# EAGLE schematic Clocks_Freq_Synth_board (EAGLE 9.6.2)
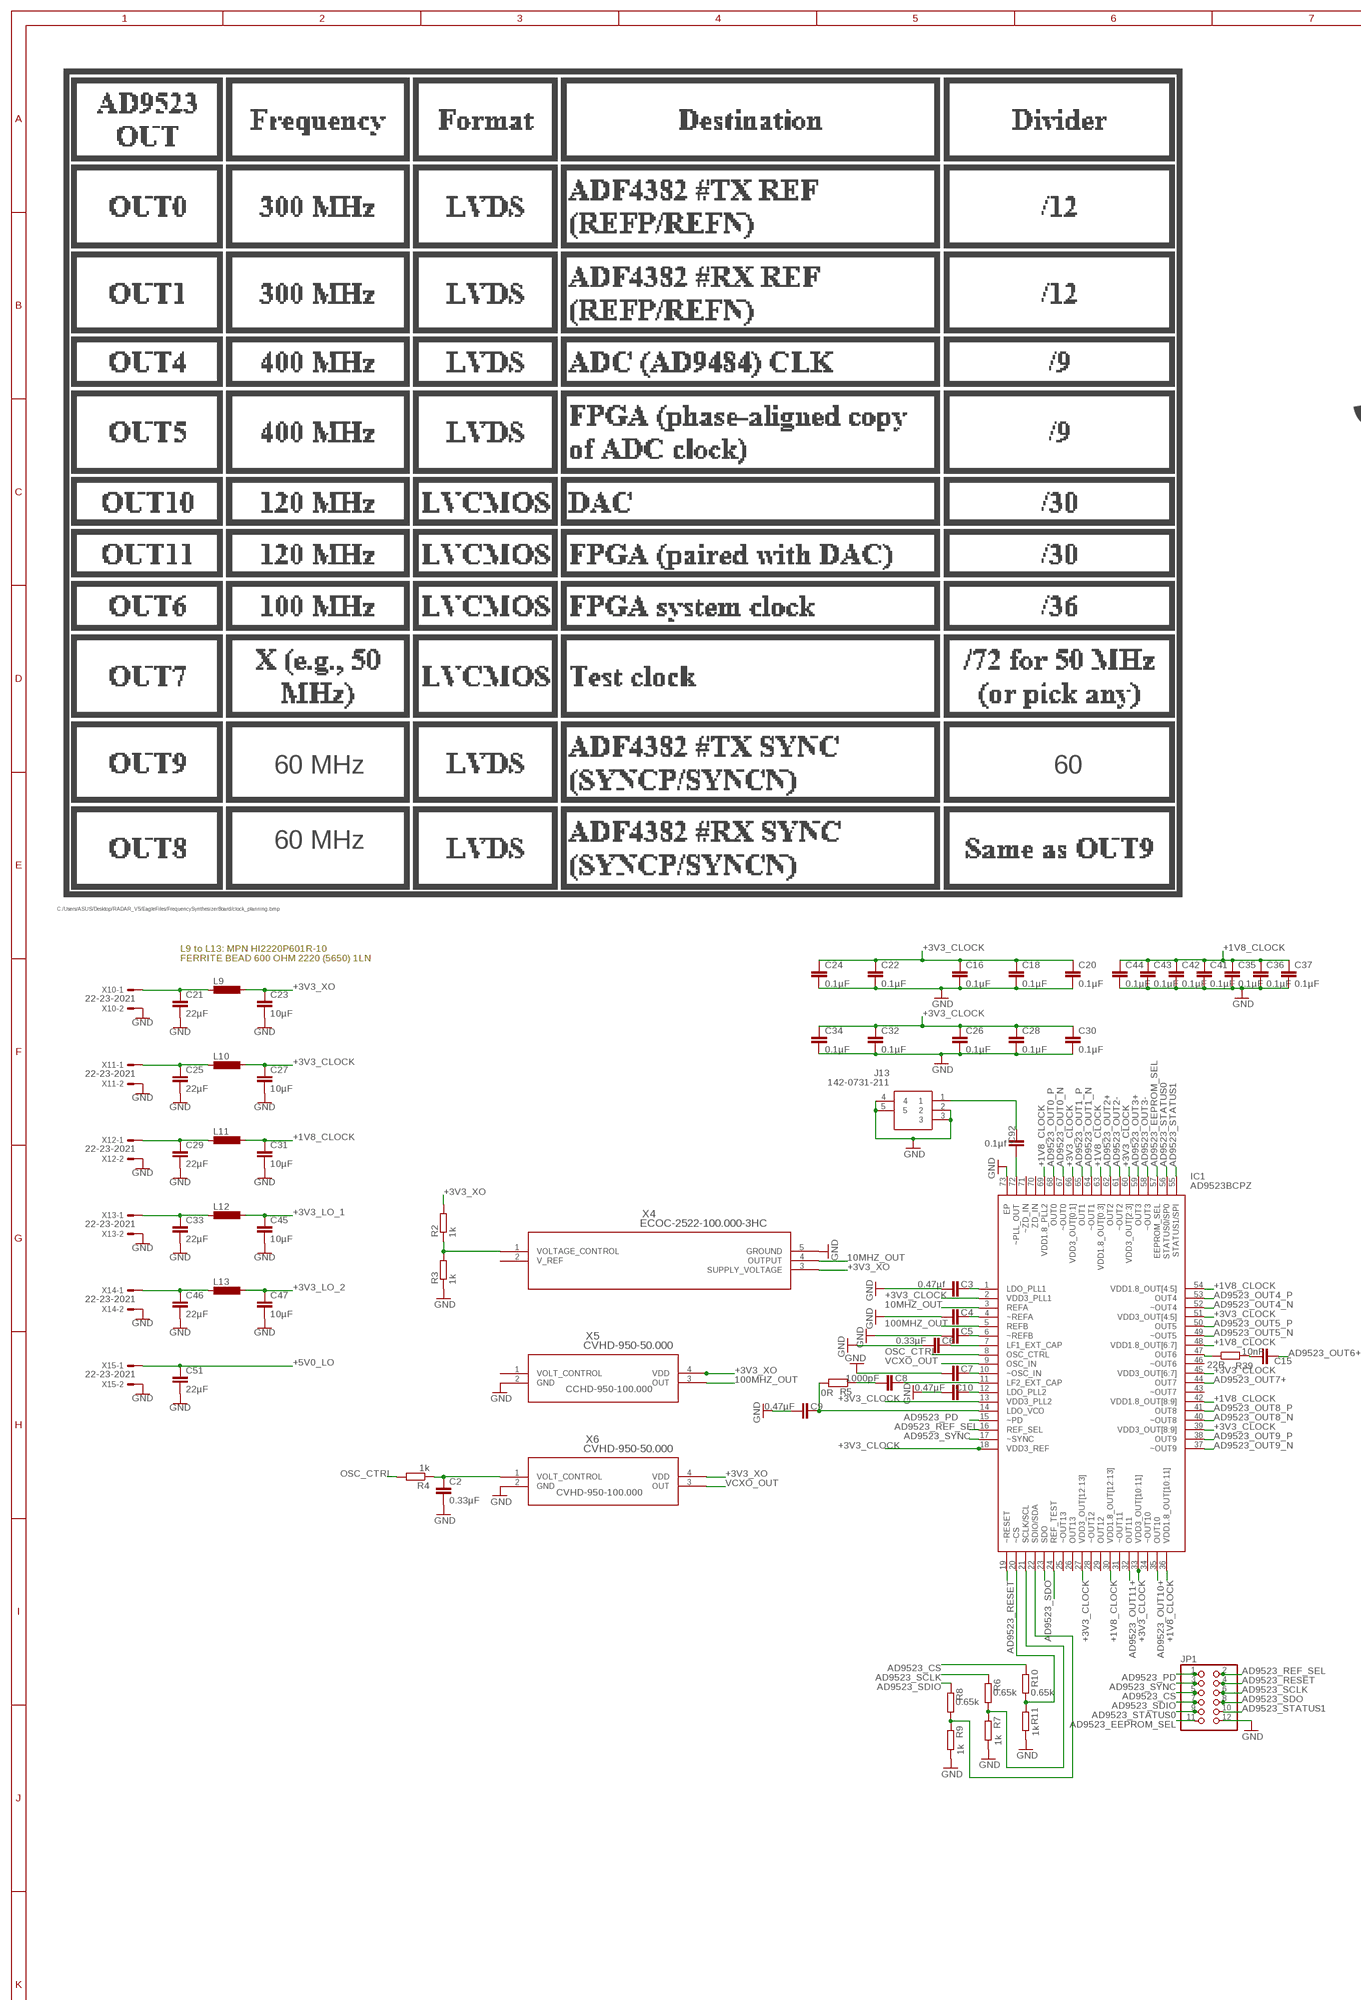
[diagram p0: schematic, sheet 1, part 1 of 3]
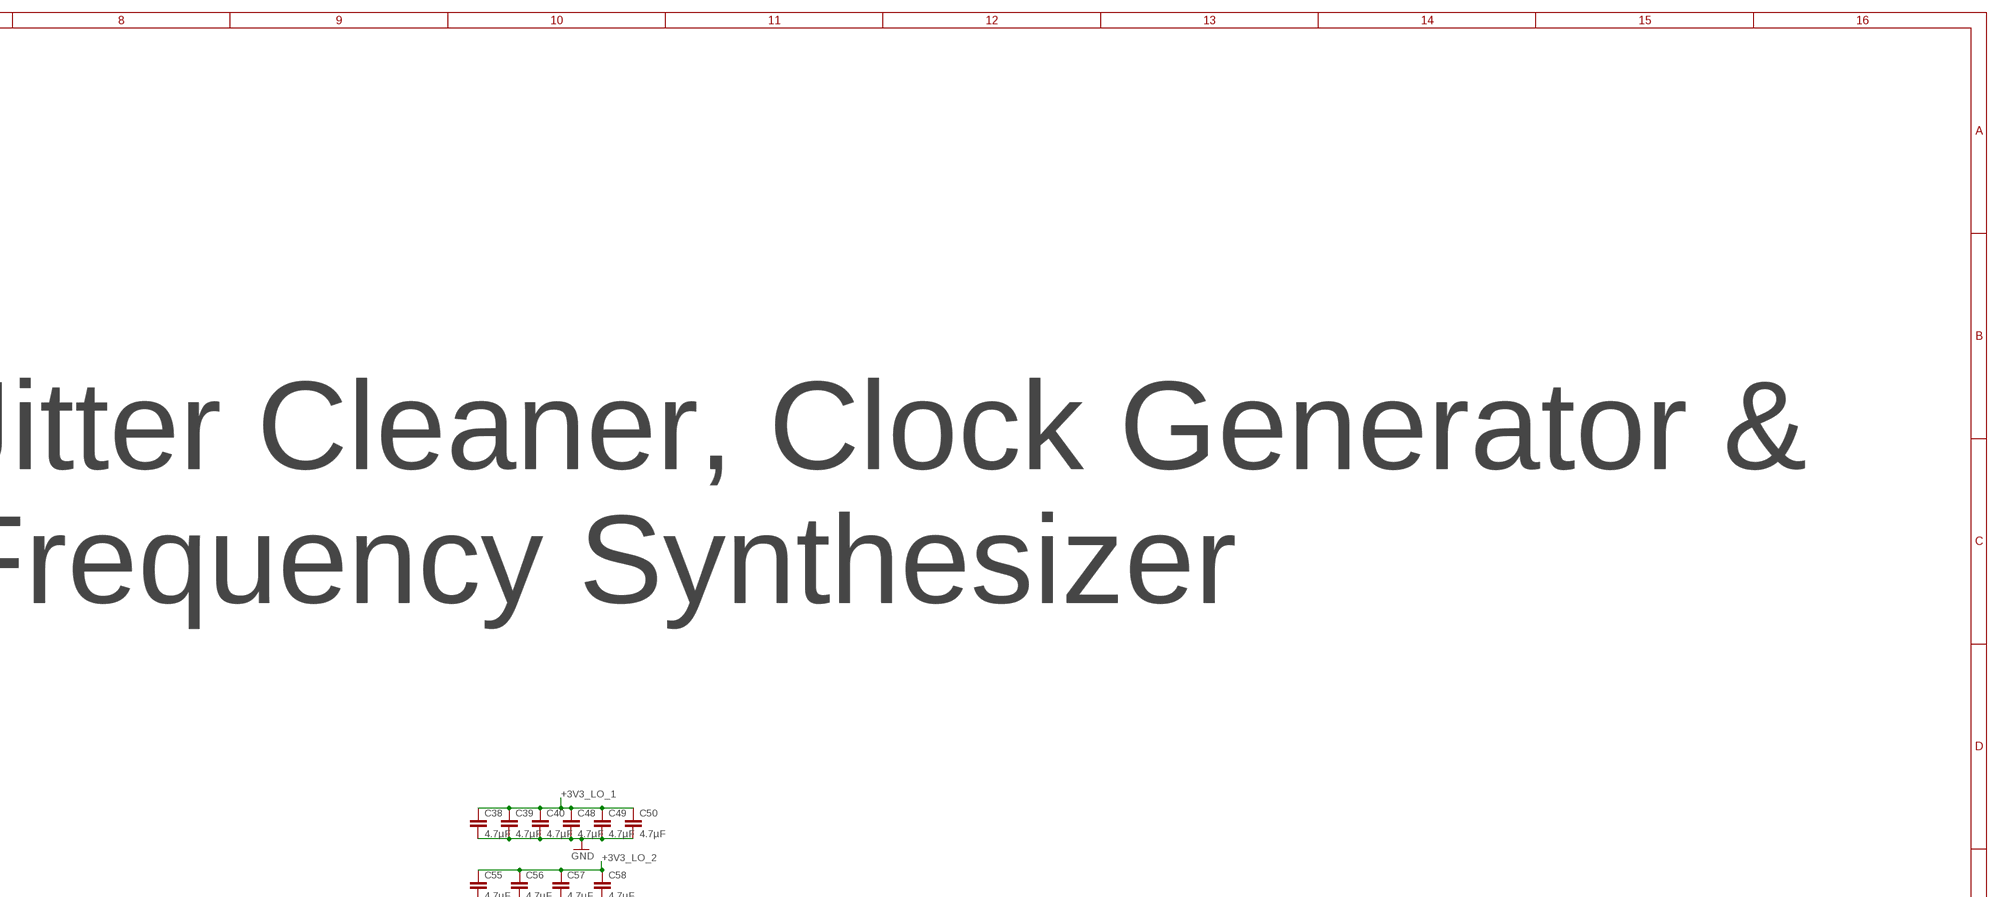
[diagram p1: schematic, sheet 1, part 2 of 3]
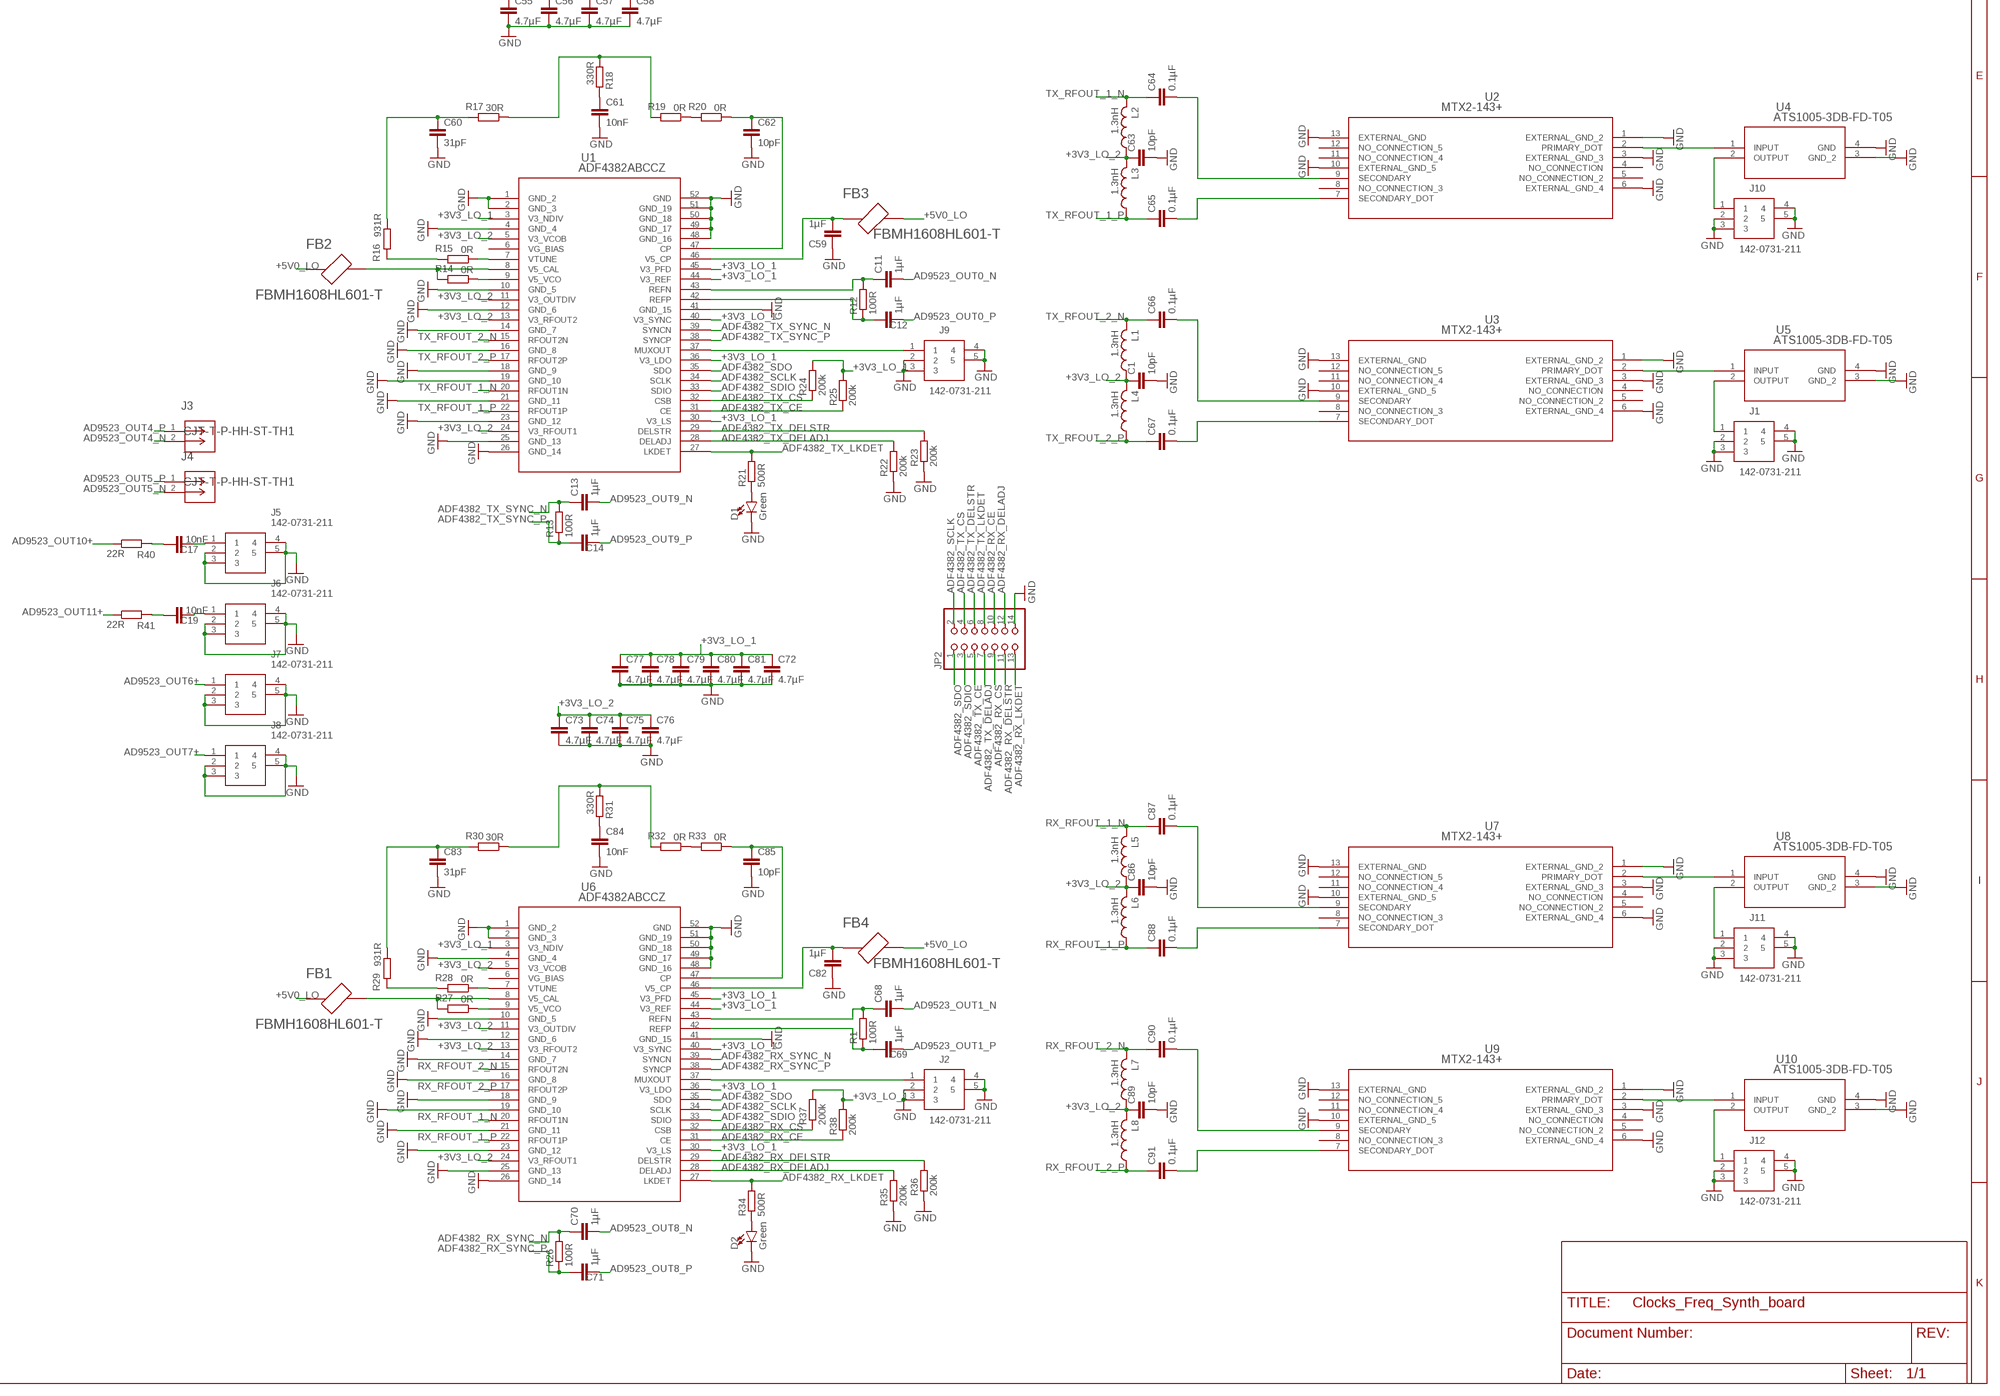
[diagram p2: schematic, sheet 1, part 3 of 3]

## Parts
C1  10pF  C-EUC0201  [C0201]
C2  0.33µF  C-EUC0201  [C0201]
C3  0.47µf  C-EUC0201  [C0201]
C4  C-EUC0201  [C0201]
C5  C-EUC0201  [C0201]
C6  0.33µF  C-EUC0201  [C0201]
C7  C-EUC0201  [C0201]
C8  1000pF  C-EUC0201  [C0201]
C9  0.47µF  C-EUC0201  [C0201]
C10  0.47µF  C-EUC0201  [C0201]
C11  1µF  C-EUC0201  [C0201]
C12  1µF  C-EUC0201  [C0201]
C13  1µF  C-EUC0201  [C0201]
C14  1µF  C-EUC0201  [C0201]
C15  10nF  C-EUC0402  [C0402]
C16  0.1µF  C-EUC0201  [C0201]
C17  10nF  C-EUC0402  [C0402]
C18  0.1µF  C-EUC0201  [C0201]
C19  10nF  C-EUC0402  [C0402]
C20  0.1µF  C-EUC0201  [C0201]
C21  22µF  C-EUC1210  [C1210]
C22  0.1µF  C-EUC0201  [C0201]
C23  10µF  C-EUC1210  [C1210]
C24  0.1µF  C-EUC0201  [C0201]
C25  22µF  C-EUC1210  [C1210]
C26  0.1µF  C-EUC0201  [C0201]
C27  10µF  C-EUC1210  [C1210]
C28  0.1µF  C-EUC0201  [C0201]
C29  22µF  C-EUC1210  [C1210]
C30  0.1µF  C-EUC0201  [C0201]
C31  10µF  C-EUC1210  [C1210]
C32  0.1µF  C-EUC0201  [C0201]
C33  22µF  C-EUC1210  [C1210]
C34  0.1µF  C-EUC0201  [C0201]
C35  0.1µF  C-EUC0201  [C0201]
C36  0.1µF  C-EUC0201  [C0201]
C37  0.1µF  C-EUC0201  [C0201]
C38  4.7µF  C-EUC0201  [C0201]
C39  4.7µF  C-EUC0201  [C0201]
C40  4.7µF  C-EUC0201  [C0201]
C41  0.1µF  C-EUC0201  [C0201]
C42  0.1µF  C-EUC0201  [C0201]
C43  0.1µF  C-EUC0201  [C0201]
C44  0.1µF  C-EUC0201  [C0201]
C45  10µF  C-EUC1210  [C1210]
C46  22µF  C-EUC1210  [C1210]
C47  10µF  C-EUC1210  [C1210]
C48  4.7µF  C-EUC0201  [C0201]
C49  4.7µF  C-EUC0201  [C0201]
C50  4.7µF  C-EUC0201  [C0201]
C51  22µF  C-EUC1210  [C1210]
C55  4.7µF  C-EUC0201  [C0201]
C56  4.7µF  C-EUC0201  [C0201]
C57  4.7µF  C-EUC0201  [C0201]
C58  4.7µF  C-EUC0201  [C0201]
C59  1µF  C-EUC0201  [C0201]
C60  31pF  C-EUC0201  [C0201]
C61  10nF  C-EUC0201  [C0201]
C62  10pF  C-EUC0201  [C0201]
C63  10pF  C-EUC0201  [C0201]
C64  0.1µF  C-EUC0201  [C0201]
C65  0.1µF  C-EUC0201  [C0201]
C66  0.1µF  C-EUC0201  [C0201]
C67  0.1µF  C-EUC0201  [C0201]
C68  1µF  C-EUC0201  [C0201]
C69  1µF  C-EUC0201  [C0201]
C70  1µF  C-EUC0201  [C0201]
C71  1µF  C-EUC0201  [C0201]
C72  4.7µF  C-EUC0201  [C0201]
C73  4.7µF  C-EUC0201  [C0201]
C74  4.7µF  C-EUC0201  [C0201]
C75  4.7µF  C-EUC0201  [C0201]
C76  4.7µF  C-EUC0201  [C0201]
C77  4.7µF  C-EUC0201  [C0201]
C78  4.7µF  C-EUC0201  [C0201]
C79  4.7µF  C-EUC0201  [C0201]
C80  4.7µF  C-EUC0201  [C0201]
C81  4.7µF  C-EUC0201  [C0201]
C82  1µF  C-EUC0201  [C0201]
C83  31pF  C-EUC0201  [C0201]
C84  10nF  C-EUC0201  [C0201]
C85  10pF  C-EUC0201  [C0201]
C86  10pF  C-EUC0201  [C0201]
C87  0.1µF  C-EUC0201  [C0201]
C88  0.1µF  C-EUC0201  [C0201]
C89  10pF  C-EUC0201  [C0201]
C90  0.1µF  C-EUC0201  [C0201]
C91  0.1µF  C-EUC0201  [C0201]
C92  0.1µf  C-EUC0201  [C0201]
D1  Green  LED-GREEN-0603-WE  [LED-0603]
D2  Green  LED-GREEN-0603-WE  [LED-0603]
FB1  FBMH1608HL601-T  [BEADC1608X90N]
FB2  FBMH1608HL601-T  [BEADC1608X90N]
FB3  FBMH1608HL601-T  [BEADC1608X90N]
FB4  FBMH1608HL601-T  [BEADC1608X90N]
IC1  AD9523BCPZ  [QFN50P1000X1000X100-73N]
J1  142-0731-211  [1420731211]
J2  142-0731-211  [1420731211]
J3  CJT-T-P-HH-ST-TH1  [CONN_CJT-T-P-XX-ST-TH1_SAI]
J4  CJT-T-P-HH-ST-TH1  [CONN_CJT-T-P-XX-ST-TH1_SAI]
J5  142-0731-211  [1420731211]
J6  142-0731-211  [1420731211]
J7  142-0731-211  [1420731211]
J8  142-0731-211  [1420731211]
J9  142-0731-211  [1420731211]
J10  142-0731-211  [1420731211]
J11  142-0731-211  [1420731211]
J12  142-0731-211  [1420731211]
J13  142-0731-211  [1420731211]
JP1  PINHD-2X6  [2X06]
JP2  PINHD-2X7  [2X07]
L1  1.3nH  L-USL0201  [L0201]
L2  1.3nH  L-USL0201  [L0201]
L3  1.3nH  L-USL0201  [L0201]
L4  1.3nH  L-USL0201  [L0201]
L5  1.3nH  L-USL0201  [L0201]
L6  1.3nH  L-USL0201  [L0201]
L7  1.3nH  L-USL0201  [L0201]
L8  1.3nH  L-USL0201  [L0201]
L9  L-EUL5650M  [L5650M]
L10  L-EUL5650M  [L5650M]
L11  L-EUL5650M  [L5650M]
L12  L-EUL5650M  [L5650M]
L13  L-EUL5650M  [L5650M]
R1  100R  R-EU_R0201  [R0201]
R2  1k  R-EU_R0201  [R0201]
R3  1k  R-EU_R0201  [R0201]
R4  1k  R-EU_R0201  [R0201]
R5  0R  R-EU_R0201  [R0201]
R6  0.65k  R-EU_R0201  [R0201]
R7  1k  R-EU_R0201  [R0201]
R8  0.65k  R-EU_R0201  [R0201]
R9  1k  R-EU_R0201  [R0201]
R10  0.65k  R-EU_R0201  [R0201]
R11  1k  R-EU_R0201  [R0201]
R12  100R  R-EU_R0201  [R0201]
R13  100R  R-EU_R0201  [R0201]
R14  0R  R-EU_R0201  [R0201]
R15  0R  R-EU_R0201  [R0201]
R16  931R  R-EU_R0201  [R0201]
R17  30R  R-EU_R0201  [R0201]
R18  330R  R-EU_R0201  [R0201]
R19  0R  R-EU_R0201  [R0201]
R20  0R  R-EU_R0201  [R0201]
R21  500R  R-EU_R0201  [R0201]
R22  200k  R-EU_R0201  [R0201]
R23  200k  R-EU_R0201  [R0201]
R24  200k  R-EU_R0201  [R0201]
R25  200k  R-EU_R0201  [R0201]
R26  100R  R-EU_R0201  [R0201]
R27  0R  R-EU_R0201  [R0201]
R28  0R  R-EU_R0201  [R0201]
R29  931R  R-EU_R0201  [R0201]
R30  30R  R-EU_R0201  [R0201]
R31  330R  R-EU_R0201  [R0201]
R32  0R  R-EU_R0201  [R0201]
R33  0R  R-EU_R0201  [R0201]
R34  500R  R-EU_R0201  [R0201]
R35  200k  R-EU_R0201  [R0201]
R36  200k  R-EU_R0201  [R0201]
R37  200k  R-EU_R0201  [R0201]
R38  200k  R-EU_R0201  [R0201]
R39  22R  R-EU_R0201  [R0201]
R40  22R  R-EU_R0201  [R0201]
R41  22R  R-EU_R0201  [R0201]
U1  ADF4382ABCCZ  [CC-48-10_ADI]
U2  MTX2-143+  [DQ1225_MNC]
U3  MTX2-143+  [DQ1225_MNC]
U4  ATS1005-3DB-FD-T05  [SMT_DB-FD-T05_SUS]
U5  ATS1005-3DB-FD-T05  [SMT_DB-FD-T05_SUS]
U6  ADF4382ABCCZ  [CC-48-10_ADI]
U7  MTX2-143+  [DQ1225_MNC]
U8  ATS1005-3DB-FD-T05  [SMT_DB-FD-T05_SUS]
U9  MTX2-143+  [DQ1225_MNC]
U10  ATS1005-3DB-FD-T05  [SMT_DB-FD-T05_SUS]
X4  ECOC-2522-100.000-3HC  [SMD5_ECOC-2522_25P4X22_ECS]
X5  CVHD-950-50.000  [SMD4_CVHD-950_CRX]
X6  CVHD-950-50.000  [SMD4_CVHD-950_CRX]
X10  22-23-2021  [22-23-2021]
X11  22-23-2021  [22-23-2021]
X12  22-23-2021  [22-23-2021]
X13  22-23-2021  [22-23-2021]
X14  22-23-2021  [22-23-2021]
X15  22-23-2021  [22-23-2021]

## Nets
10MHZ_OUT: IC1.3(REFA) X4.4(OUTPUT)
100MHZ_OUT: IC1.5(REFB) X5.3(OUT)
+1V8_CLOCK: C31.1 C35.1 C36.1 C37.1 C41.1 C42.1 C43.1 C44.1 IC1.30(VDD1.8_OUT[12:13]) IC1.36(VDD1.8_OUT[10:11]) IC1.42(VDD1.8_OUT[8:9]) IC1.48(VDD1.8_OUT[6:7]) IC1.54(VDD1.8_OUT[4:5]) IC1.63(VDD1.8_OUT[0:3]) IC1.69(VDD1.8_PLL2) L11.1
+3V3_CLOCK: C16.1 C18.1 C20.1 C22.1 C24.1 C26.1 C27.1 C28.1 C30.1 C32.1 C34.1 IC1.2(VDD3_PLL1) IC1.13(VDD3_PLL2) IC1.18(VDD3_REF) IC1.27(VDD3_OUT[12:13]) IC1.33(VDD3_OUT[10:11]) IC1.39(VDD3_OUT[8:9]) IC1.45(VDD3_OUT[6:7]) IC1.51(VDD3_OUT[4:5]) IC1.60(VDD3_OUT[2:3]) IC1.66(VDD3_OUT[0:1]) L10.1
+3V3_LO_1: C38.1 C39.1 C40.1 C45.1 C48.1 C49.1 C50.1 C72.1 C77.1 C78.1 C79.1 C80.1 C81.1 L12.1 R24.2 R25.2 R37.2 R38.2 U1.3(V3_NDIV) U1.30(V3_LS) U1.36(V3_LDO) U1.40(V3_SYNC) U1.44(V3_REF) U1.45(V3_PFD) U6.3(V3_NDIV) U6.30(V3_LS) U6.36(V3_LDO) U6.40(V3_SYNC) U6.44(V3_REF) U6.45(V3_PFD)
+3V3_LO_2: C1.1 C47.1 C55.1 C56.1 C57.1 C58.1 C63.1 C73.1 C74.1 C75.1 C76.1 C86.1 C89.1 L1.1 L2.1 L3.2 L4.2 L5.1 L6.2 L7.1 L8.2 L13.1 U1.5(V3_VCOB) U1.11(V3_OUTDIV) U1.13(V3_RFOUT2) U1.24(V3_RFOUT1) U6.5(V3_VCOB) U6.11(V3_OUTDIV) U6.13(V3_RFOUT2) U6.24(V3_RFOUT1)
+3V3_XO: C23.1 L9.1 R2.2 X4.3(SUPPLY_VOLTAGE) X5.4(VDD) X6.4(VDD)
+5V0_LO: C51.1 FB1.1 FB2.1 FB3.2 FB4.2 X15.1
AD9523_CS: JP1.5 R10.1
AD9523_EEPROM_SEL: IC1.57(EEPROM_SEL) JP1.11
AD9523_OUT0_N [Differential]: C11.2 IC1.67(~OUT0)
AD9523_OUT0_P [Differential]: C12.2 IC1.68(OUT0)
AD9523_OUT1_N [Differential]: C68.2 IC1.64(~OUT1)
AD9523_OUT1_P [Differential]: C69.2 IC1.65(OUT1)
AD9523_OUT2+: IC1.62(OUT2)
AD9523_OUT2-: IC1.61(~OUT2)
AD9523_OUT3+: IC1.59(OUT3)
AD9523_OUT3-: IC1.58(~OUT3)
AD9523_OUT4_N [Differential]: IC1.52(~OUT4) J3.2
AD9523_OUT4_P [Differential]: IC1.53(OUT4) J3.1
AD9523_OUT5_N [Differential]: IC1.49(~OUT5) J4.2
AD9523_OUT5_P [Differential]: IC1.50(OUT5) J4.1
AD9523_OUT6+: C15.2 J7.1
AD9523_OUT6_DRV: IC1.47(OUT6) R39.1
AD9523_OUT6_SER: C15.1 R39.2
AD9523_OUT7+: IC1.44(OUT7) J8.1
AD9523_OUT8_N [Differential]: C70.2 IC1.40(~OUT8)
AD9523_OUT8_P [Differential]: C71.2 IC1.41(OUT8)
AD9523_OUT9_N [Differential]: C13.2 IC1.37(~OUT9)
AD9523_OUT9_P [Differential]: C14.2 IC1.38(OUT9)
AD9523_OUT10+: IC1.35(OUT10) R40.1
AD9523_OUT10_SER: C17.1 R40.2
AD9523_OUT11+: IC1.32(OUT11) R41.1
AD9523_OUT11_SER: C19.1 R41.2
AD9523_PD: IC1.15(~PD) JP1.1
AD9523_REF_SEL: IC1.16(REF_SEL) JP1.2
AD9523_RESET: IC1.19(~RESET) JP1.4
AD9523_SCLK: JP1.6 R6.1
AD9523_SDIO: JP1.7 R8.1
AD9523_SDO: IC1.23(SDO) JP1.8
AD9523_STATUS0: IC1.56(STATUS0/SP0) JP1.9
AD9523_STATUS1: IC1.55(STATUS1/SPI) JP1.10
AD9523_SYNC: IC1.17(~SYNC) JP1.3
ADF4382_RX_CE: JP2.10 R38.1 U6.31(CE)
ADF4382_RX_CS: JP2.9 R37.1 U6.32(CSB)
ADF4382_RX_DELADJ: JP2.12 R35.2 U6.28(DELADJ)
ADF4382_RX_DELSTR: JP2.11 R36.2 U6.29(DELSTR)
ADF4382_RX_LKDET: JP2.13 R34.2 U6.27(LKDET)
ADF4382_RX_SYNC_N [Differential]: C70.1 R26.2 U6.39(SYNCN)
ADF4382_RX_SYNC_P [Differential]: C71.1 R26.1 U6.38(SYNCP)
ADF4382_SCLK: JP2.2 U1.34(SCLK) U6.34(SCLK)
ADF4382_SDIO: JP2.3 U1.33(SDIO) U6.33(SDIO)
ADF4382_SDO: JP2.1 U1.35(SDO) U6.35(SDO)
ADF4382_TX_CE: JP2.5 R25.1 U1.31(CE)
ADF4382_TX_CS: JP2.4 R24.1 U1.32(CSB)
ADF4382_TX_DELADJ: JP2.7 R22.2 U1.28(DELADJ)
ADF4382_TX_DELSTR: JP2.6 R23.2 U1.29(DELSTR)
ADF4382_TX_LKDET: JP2.8 R21.2 U1.27(LKDET)
ADF4382_TX_SYNC_N [Differential]: C13.1 R13.2 U1.39(SYNCN)
ADF4382_TX_SYNC_P [Differential]: C14.1 R13.1 U1.38(SYNCP)
GND: C1.2 C2.2 C3.1 C4.1 C5.1 C6.1 C7.1 C9.1 C10.1 C16.2 C18.2 C20.2 C21.2 C22.2 C23.2 C24.2 C25.2 C26.2 C27.2 C28.2 C29.2 C30.2 C31.2 C32.2 C33.2 C34.2 C35.2 C36.2 C37.2 C38.2 C39.2 C40.2 C41.2 C42.2 C43.2 C44.2 C45.2 C46.2 C47.2 C48.2 C49.2 C50.2 C51.2 C55.2 C56.2 C57.2 C58.2 C59.1 C60.2 C61.2 C62.2 C63.2 C72.2 C73.2 C74.2 C75.2 C76.2 C77.2 C78.2 C79.2 C80.2 C81.2 C82.1 C83.2 C84.2 C85.2 C86.2 C89.2 D1.C D2.C IC1.73(EP) J1.2 J1.3 J1.4 J1.5 J2.2 J2.3 J2.4 J2.5 J5.2 J5.3 J5.4 J5.5 J6.2 J6.3 J6.4 J6.5 J7.2 J7.3 J7.4 J7.5 J8.2 J8.3 J8.4 J8.5 J9.2 J9.3 J9.4 J9.5 J10.2 J10.3 J10.4 J10.5 J11.2 J11.3 J11.4 J11.5 J12.2 J12.3 J12.4 J12.5 J13.2 J13.3 J13.4 J13.5 JP1.12 JP2.14 R3.1 R7.2 R9.2 R11.2 R22.1 R23.1 R35.1 R36.1 U1.1(GND_2) U1.2(GND_3) U1.4(GND_4) U1.10(GND_5) U1.12(GND_6) U1.14(GND_7) U1.16(GND_8) U1.18(GND_9) U1.19(GND_10) U1.21(GND_11) U1.23(GND_12) U1.25(GND_13) U1.26(GND_14) U1.41(GND_15) U1.48(GND_16) U1.49(GND_17) U1.50(GND_18) U1.51(GND_19) U1.52(GND) U2.1(EXTERNAL_GND_2) U2.3(EXTERNAL_GND_3) U2.6(EXTERNAL_GND_4) U2.10(EXTERNAL_GND_5) U2.13(EXTERNAL_GND) U3.1(EXTERNAL_GND_2) U3.3(EXTERNAL_GND_3) U3.6(EXTERNAL_GND_4) U3.10(EXTERNAL_GND_5) U3.13(EXTERNAL_GND) U4.3(GND_2) U4.4(GND) U5.3(GND_2) U5.4(GND) U6.1(GND_2) U6.2(GND_3) U6.4(GND_4) U6.10(GND_5) U6.12(GND_6) U6.14(GND_7) U6.16(GND_8) U6.18(GND_9) U6.19(GND_10) U6.21(GND_11) U6.23(GND_12) U6.25(GND_13) U6.26(GND_14) U6.41(GND_15) U6.48(GND_16) U6.49(GND_17) U6.50(GND_18) U6.51(GND_19) U6.52(GND) U7.1(EXTERNAL_GND_2) U7.3(EXTERNAL_GND_3) U7.6(EXTERNAL_GND_4) U7.10(EXTERNAL_GND_5) U7.13(EXTERNAL_GND) U8.3(GND_2) U8.4(GND) U9.1(EXTERNAL_GND_2) U9.3(EXTERNAL_GND_3) U9.6(EXTERNAL_GND_4) U9.10(EXTERNAL_GND_5) U9.13(EXTERNAL_GND) U10.3(GND_2) U10.4(GND) X4.5(GROUND) X5.2(GND) X6.2(GND) X10.2 X11.2 X12.2 X13.2 X14.2 X15.2
N$1: R2.1 R3.2 X4.1(VOLTAGE_CONTROL)
N$2: C2.1 R4.1 X6.1(VOLT_CONTROL)
N$3: C3.2 IC1.1(LDO_PLL1)
N$4: C6.2 IC1.7(LF1_EXT_CAP)
N$5: C4.2 IC1.4(~REFA)
N$6: C5.2 IC1.6(~REFB)
N$7: C7.2 IC1.10(~OSC_IN)
N$8: C8.2 IC1.11(LF2_EXT_CAP)
N$9: C8.1 R5.1
N$10: C9.2 IC1.14(LDO_VCO) R5.2
N$11: C10.2 IC1.12(LDO_PLL2)
N$12: IC1.21(SCLK/SCL) R6.2 R7.1
N$13: IC1.22(SDIO/SDA) R8.2 R9.1
N$14: IC1.20(~CS) R10.2 R11.1
N$15: C11.1 R12.2 U1.43(REFN)
N$16: C12.1 R12.1 U1.42(REFP)
N$17: C61.1 R18.2
N$18: R14.1 U1.9(V5_VCO)
N$19: FB2.2 R14.2 U1.8(V5_CAL)
N$20: C59.2 FB3.1 U1.46(V5_CP)
N$21: R19.1 R20.2
N$22: R15.1 U1.7(VTUNE)
N$23: R15.2 R16.2
N$24: C60.1 R16.1 R17.2
N$25: R17.1 R18.1 R19.2
N$26: C62.1 R20.1 U1.47(CP)
N$27: U2.2(PRIMARY_DOT) U4.1(INPUT)
N$28: C65.2 U2.7(SECONDARY_DOT)
N$29: IC1.24(REF_TEST)
N$30: J10.1 U4.2(OUTPUT)
N$31: C64.2 U2.9(SECONDARY)
N$32: C67.2 U3.7(SECONDARY_DOT)
N$33: C66.2 U3.9(SECONDARY)
N$34: U3.2(PRIMARY_DOT) U5.1(INPUT)
N$35: J1.1 U5.2(OUTPUT)
N$36: D1.A R21.1
N$37: J9.1 U1.37(MUXOUT)
N$38: C68.1 R1.2 U6.43(REFN)
N$39: C69.1 R1.1 U6.42(REFP)
N$40: R27.1 U6.9(V5_VCO)
N$41: FB1.2 R27.2 U6.8(V5_CAL)
N$42: C82.2 FB4.1 U6.46(V5_CP)
N$43: C84.1 R31.2
N$44: R32.1 R33.2
N$45: R28.1 U6.7(VTUNE)
N$46: R28.2 R29.2
N$47: C83.1 R29.1 R30.2
N$48: R30.1 R31.1 R32.2
N$49: C85.1 R33.1 U6.47(CP)
N$50: D2.A R34.1
N$51: J2.1 U6.37(MUXOUT)
N$52: C88.2 U7.7(SECONDARY_DOT)
N$53: C87.2 U7.9(SECONDARY)
N$54: U7.2(PRIMARY_DOT) U8.1(INPUT)
N$55: J11.1 U8.2(OUTPUT)
N$56: C91.2 U9.7(SECONDARY_DOT)
N$57: C90.2 U9.9(SECONDARY)
N$58: U9.2(PRIMARY_DOT) U10.1(INPUT)
N$59: J12.1 U10.2(OUTPUT)
N$60: C92.1 IC1.72(~PLL_OUT)
N$61: C92.2 J13.1
N$64: C17.2 J5.1
N$67: C19.2 J6.1
N$69: C21.1 L9.2 X10.1
N$71: C25.1 L10.2 X11.1
N$73: C29.1 L11.2 X12.1
N$75: C33.1 L12.2 X13.1
N$77: C46.1 L13.2 X14.1
OSC_CTRL: IC1.8(OSC_CTRL) R4.2
RX_RFOUT_1_N [Differential]: C87.1 L5.2 U6.20(RFOUT1N)
RX_RFOUT_1_P [Differential]: C88.1 L6.1 U6.22(RFOUT1P)
RX_RFOUT_2_N [Differential]: C90.1 L7.2 U6.15(RFOUT2N)
RX_RFOUT_2_P [Differential]: C91.1 L8.1 U6.17(RFOUT2P)
TX_RFOUT_1_N [Differential]: C64.1 L2.2 U1.20(RFOUT1N)
TX_RFOUT_1_P [Differential]: C65.1 L3.1 U1.22(RFOUT1P)
TX_RFOUT_2_N [Differential]: C66.1 L1.2 U1.15(RFOUT2N)
TX_RFOUT_2_P [Differential]: C67.1 L4.1 U1.17(RFOUT2P)
VCXO_OUT: IC1.9(OSC_IN) X6.3(OUT)
Unconnected: IC1.25(~OUT13) IC1.26(OUT13) IC1.28(~OUT12) IC1.29(OUT12) IC1.31(~OUT11) IC1.34(~OUT10) IC1.43(~OUT7) IC1.46(~OUT6) IC1.70(ZD_IN) IC1.71(~ZD_IN) U1.6(VG_BIAS) U2.4(NO_CONNECTION) U2.5(NO_CONNECTION_2) U2.8(NO_CONNECTION_3) U2.11(NO_CONNECTION_4) U2.12(NO_CONNECTION_5) U3.4(NO_CONNECTION) U3.5(NO_CONNECTION_2) U3.8(NO_CONNECTION_3) U3.11(NO_CONNECTION_4) U3.12(NO_CONNECTION_5) U6.6(VG_BIAS) U7.4(NO_CONNECTION) U7.5(NO_CONNECTION_2) U7.8(NO_CONNECTION_3) U7.11(NO_CONNECTION_4) U7.12(NO_CONNECTION_5) U9.4(NO_CONNECTION) U9.5(NO_CONNECTION_2) U9.8(NO_CONNECTION_3) U9.11(NO_CONNECTION_4) U9.12(NO_CONNECTION_5) X4.2(V_REF) X5.1(VOLT_CONTROL)

## Notes on the sheet
- Jitter Cleaner, Clock Generator &
  Frequency Synthesizer
- 60 MHz | 60
- 60 MHz
- C:/Users/ASUS/Desktop/RADAR_V5/EagleFiles/FrequencySynthesizerBoard/clock_planning.bmp
- L9 to L13: MPN HI2220P601R-10
  FERRITE BEAD 600 OHM 2220 (5650) 1LN
- CCHD-950-100.000
- CVHD-950-100.000

## Library data of the parts
C1-C51 C55-C92 = rcl:C-EU: CAPACITOR, European symbol; SPICEPREFIX: C
D1 D2 = SparkFun-LED:LED-GREEN: Green SMD LED Used in manufacturing of various products at SparkFun Packages: 0603 - SMD 0603 package [Product Link] <http://www.futureelectronics.com/en/technologies/semiconductors/optoelectronics/leds/Pages/9894312-LTST-C190GKT.aspx?CrossPart=HSMG-C190&IM=0> LilyPad 1206 - SMD1206 LilyPad package [Product Link] <http://www.futureelectronics.com/en/Technologies/Product.aspx?ProductID=IN150NGHARVATEKCORPORATION2049943&IM=0> 1206 - SMD1206 package [Product Link] <http://www.futureelectronics.com/en/technologies/semiconductors/optoelectronics/leds/Pages/8315665-LTST-C150KGKT.aspx?IM=0> 1206 Bottom Mount -SMD 1206 Bottom Mount [Product Link] <http://www.digikey.com/product-detail/en/lite-on-inc/LTST-C230KGKT/160-1456-1-ND/386854> SparkFun Products: Pro Mini 328 -5V <https://www.sparkfun.com/products/821> RedBoard <https://www.sparkfun.com/products/12757> MP3 Trigger <https://www.sparkfun.com/products/13720> Makey Makey <https://www.sparkfun.com/products/11076>; PROD_ID: DIO-16512
FB1-FB4 = FBMH1608HL601-T:FBMH1608HL601-T
IC1 = AD9523BCPZ:AD9523BCPZ: AD9523BCPZ, PLL Clock Driver Dual, 72-Pin LFCSP VQ Source: Datasheet <https://componentsearchengine.com/Datasheets/1/AD9523BCPZ.pdf>; DESCRIPTION: AD9523BCPZ, PLL Clock Driver Dual, 72-Pin LFCSP VQ; HEIGHT: mm; MANUFACTURER_NAME: Analog Devices; MANUFACTURER_PART_NUMBER: AD9523BCPZ; MOUSER_PART_NUMBER: 584-AD9523BCPZ; MOUSER_PRICE-STOCK: https://www.mouser.com/Search/Refine.aspx?Keyword=584-AD9523BCPZ
J1 J2 J5-J13 = 142-0731-211:142-0731-211: SMA Connector Jack, Female Socket 50 Ohms Through Hole Solder Source: Datasheet <https://www.cinch.com/media/drawings/products/rf-microwave/connectors/dr-CCS-JOHNS-142-0731-211.pdf>; DESCRIPTION: SMA Connector Jack, Female Socket 50 Ohms Through Hole Solder; HEIGHT: 9.8852mm; MANUFACTURER_NAME: Cinch Connectivity Solutions; MANUFACTURER_PART_NUMBER: 142-0731-211; MOUSER_PART_NUMBER: 530-142-0731-211; MOUSER_PRICE-STOCK: https://www.mouser.co.uk/ProductDetail/Johnson-Cinch-Connectivity-Solutions/142-0731-211?qs=HFfMDpzxxd0OVzI3hm9tuA%3D%3D
J3 J4 = My_Library_RADAR:CJT-T-P-HH-ST-TH1; COPYRIGHT: Copyright (C) 2025 Ultra Librarian. All rights reserved.; MANUFACTURER_NAME: Samtec Inc; MANUFACTURER_PART_NUMBER: CJT-T-P-HH-ST-TH1
JP1 = pinhead:PINHD-2X6: PIN HEADER
JP2 = pinhead:PINHD-2X7: PIN HEADER
L1-L8 = rcl:L-US: INDUCTOR, American symbol; SPICEPREFIX: L
L9-L13 = rcl:L-EU: INDUCTOR, European symbol; SPICEPREFIX: L
R1-R41 = rcl:R-EU_: RESISTOR, European symbol; SPICEPREFIX: R
U1 U6 = My_Library_RADAR:ADF4382ABCCZ; COPYRIGHT: Copyright (C) 2024 Ultra Librarian. All rights reserved.; MANUFACTURER_PART_NUMBER: ADF4382ABCCZ; MFR_NAME: Analog Devices Inc
U2 U3 U7 U9 = My_Library_RADAR:MTX2-143+; COPYRIGHT: Copyright (C) 2024 Ultra Librarian. All rights reserved.; MANUFACTURER_PART_NUMBER: MTX2-143+; MFR_NAME: Mini Circuits
U4 U5 U8 U10 = My_Library_RADAR:ATS1005-3DB-FD-T05; COPYRIGHT: Copyright (C) 2025 Ultra Librarian. All rights reserved.; MANUFACTURER_NAME: Susumu; MANUFACTURER_PART_NUMBER: ATS1005-3DB-FD-T05
X4 = My_Library_RADAR:ECOC-2522-100.000-3HC; COPYRIGHT: Copyright (C) 2025 Ultra Librarian. All rights reserved.; MANUFACTURER_NAME: ECS International; MANUFACTURER_PART_NUMBER: ECOC-2522-100.000-3HC
X5 X6 = My_Library_RADAR:CVHD-950-50.000; COPYRIGHT: Copyright (C) 2025 Ultra Librarian. All rights reserved.; MANUFACTURER_NAME: Crystek Crystals; MANUFACTURER_PART_NUMBER: CVHD-950-50.000
X10-X15 = con-molex:22-23-2021: .100" (2.54mm) Center Header - 2 Pin; MF: MOLEX; MPN: 22-23-2021; OC_FARNELL: 1462926; OC_NEWARK: 25C3832

## Net classes
1 Differential: width 0.204 mm, clearance 0.1 mm to class 0, clearance 0.15 mm